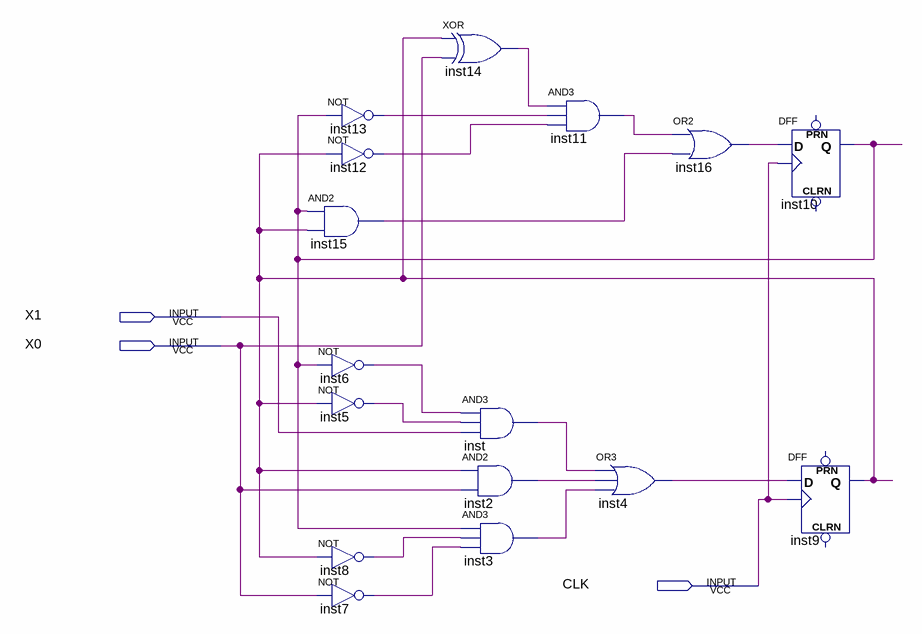
[diagram p0: schematic sheet]
// Quartus schematic ham_modulal3.bdf as structural Verilog: 16 symbols, 3 pins
module ham_modulal3 (
  input  X1,
  input  X0,
  input  CLK
);

  wire inst2_out, inst3_out, inst4_out, inst5_out, inst6_out, inst7_out, inst8_out, inst9_q, inst10_q,
       inst11_out, inst12_out, inst13_out, inst14_out, inst15_out, inst16_out, inst_out;

  not inst13 (inst13_out, inst10_q);
  not inst12 (inst12_out, inst9_q);
  and inst15 (inst15_out, inst10_q, inst9_q);
  not inst6 (inst6_out, inst10_q);
  not inst5 (inst5_out, inst9_q);
  not inst8 (inst8_out, inst9_q);
  not inst7 (inst7_out, X0);
  xor inst14 (inst14_out, inst9_q, X0);
  and inst (inst_out, inst6_out, inst5_out, X1);
  and inst2 (inst2_out, inst9_q, X0);
  and inst3 (inst3_out, inst10_q, inst8_out, inst7_out);
  and inst11 (inst11_out, inst14_out, inst13_out, inst12_out);
  or inst4 (inst4_out, inst_out, inst2_out, inst3_out);
  or inst16 (inst16_out, inst11_out, inst15_out);
  DFF inst10 (.CLK(CLK), .D(inst16_out), .Q(inst10_q));  // open: CLRN, PRN
  DFF inst9 (.CLK(CLK), .D(inst4_out), .Q(inst9_q));  // open: CLRN, PRN
endmodule
